# EAGLE design Walletv2 (EAGLE 8.7.0)
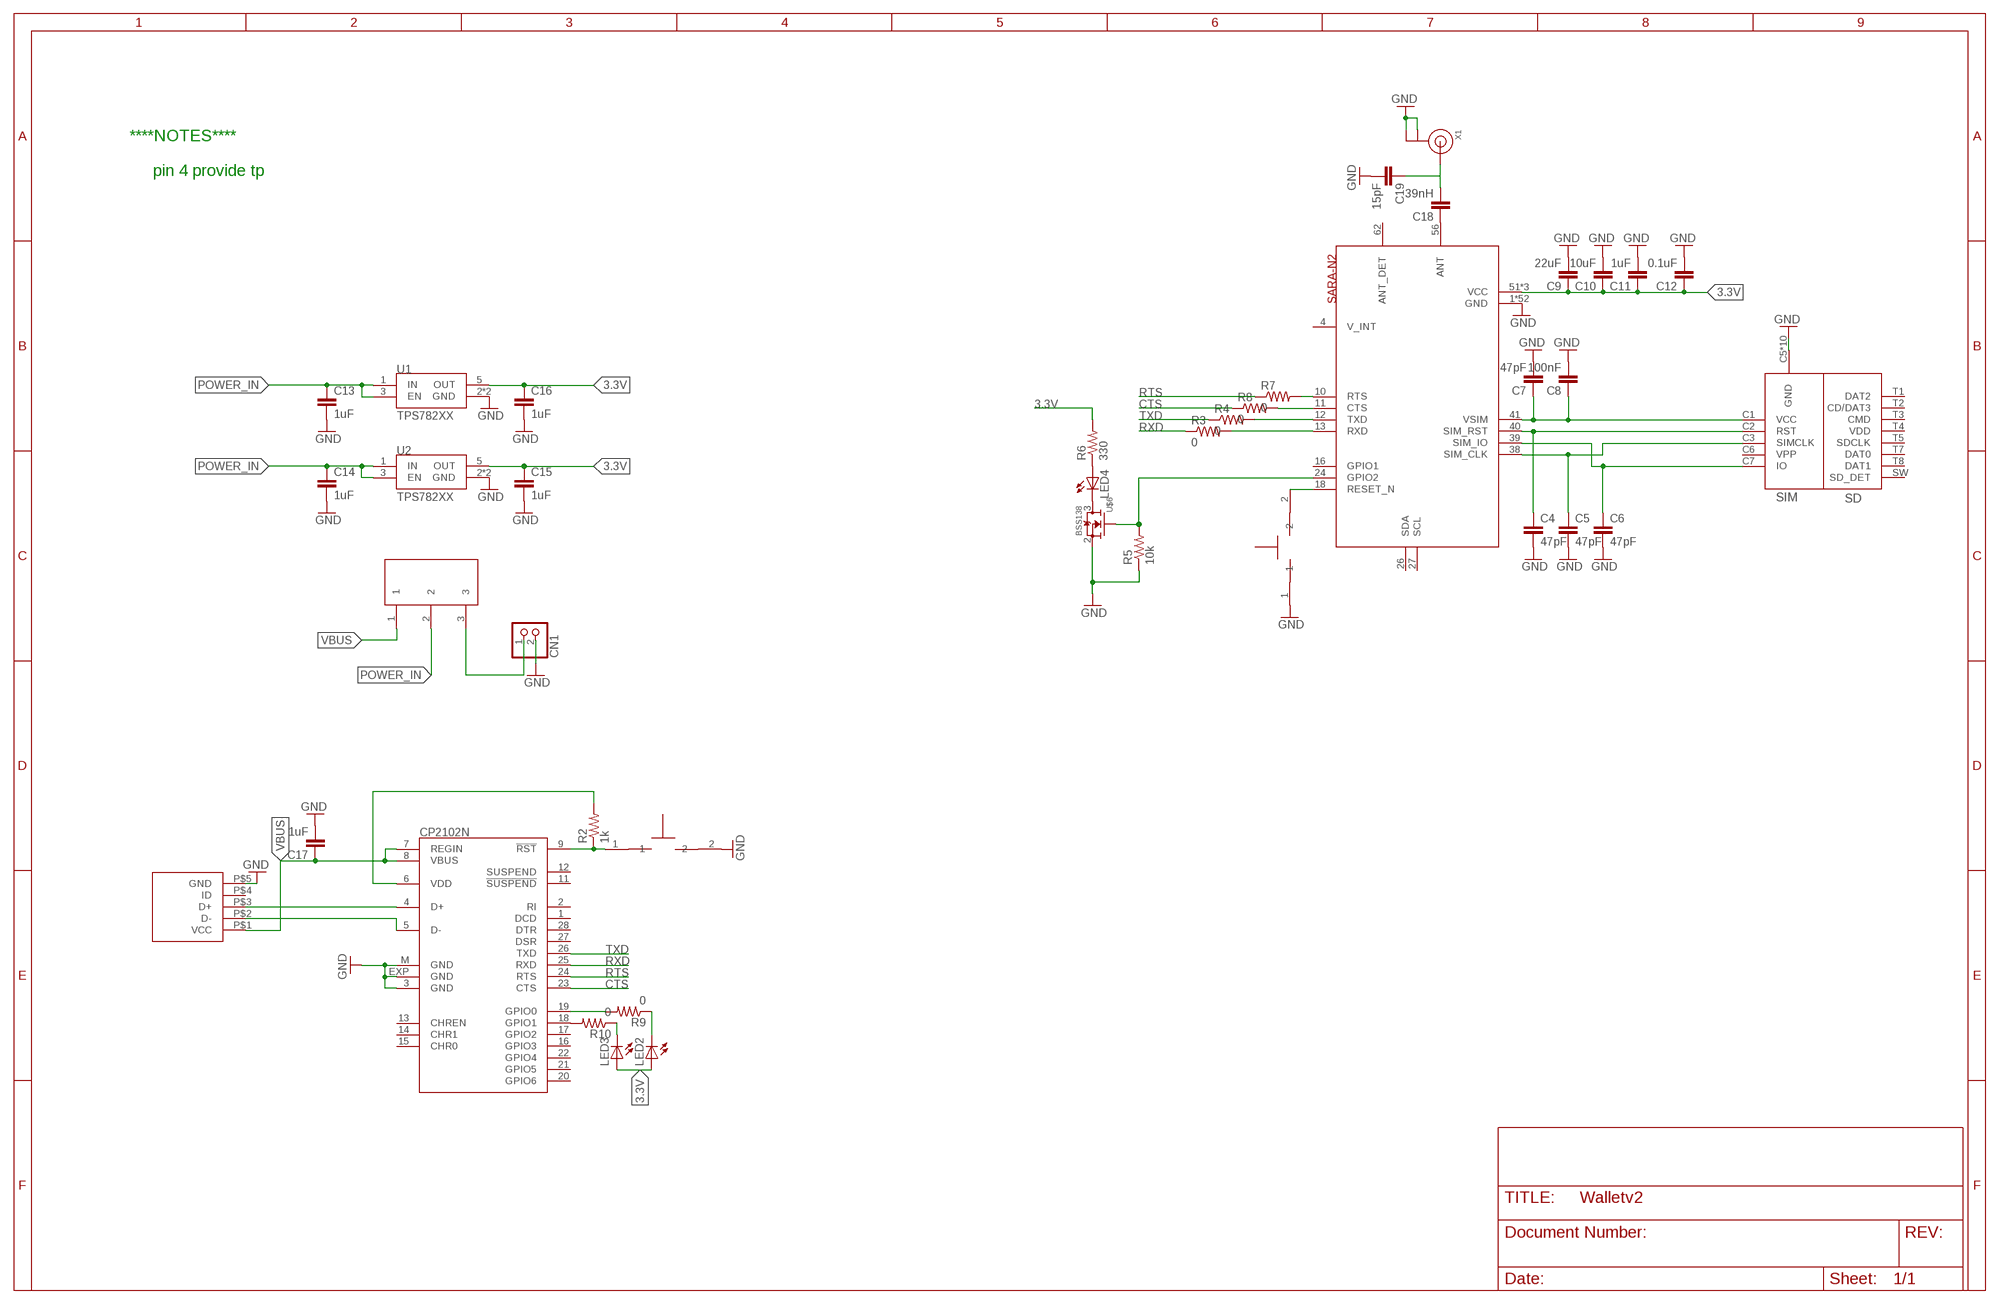
[diagram p0: schematic, sheet 1]

## Parts
C4  47pF  C-EUC0402  [C0402]
C5  47pF  C-EUC0402  [C0402]
C6  47pF  C-EUC0402  [C0402]
C7  47pF  C-EUC0402  [C0402]
C8  100nF  C-EUC0402  [C0402]
C9  22uF  C-EUC0805  [C0805]
C10  10uF  C-EUC0603  [C0603]
C11  1uF  C-EUC0402  [C0402]
C12  0.1uF  C-EUC0402  [C0402]
C13  1uF  C-EUC0402  [C0402]
C14  1uF  C-EUC0402  [C0402]
C15  1uF  C-EUC0402  [C0402]
C16  1uF  C-EUC0402  [C0402]
C17  1uF  C-EUC0402  [C0402]
C18  39nH  C-EUC0402  [C0402]
C19  15pF  C-EUC0402  [C0402]
CN1  JST_2PIN-SMT-RA  [JST-PH-2-SMT-RA]
IC1  CP2102  [MLP28]
LED2  LEDCHIPLED_0603  [CHIPLED_0603]
LED3  LEDCHIPLED_0603  [CHIPLED_0603]
LED4  LEDCHIPLED_0603  [CHIPLED_0603]
R2  1k  R-US_R0402  [R0402]
R3  0  R-US_R0402  [R0402]
R4  0  R-US_R0402  [R0402]
R5  10k  R-US_R0402  [R0402]
R6  330  R-US_R0402  [R0402]
R7  0  R-US_R0402  [R0402]
R8  0  R-US_R0402  [R0402]
R9  0  R-US_R0402  [R0402]
R10  0  R-US_R0402  [R0402]
S1  TACTILE_SKRKA  [TACTILE_SKRKA]
S2  TACTILE_SKRKA  [TACTILE_SKRKA]
U1  TPS782XX  [SOT23-5L]
U2  TPS782XX  [SOT23-5L]
U$1  SARA-N2  [SARA-N2]
U$2  SIM_SD_MOLEX  [SIM_SD_MOLEX]
U$4  SPDT_THRU  [SPDT_THRU]
U$5  MICRO_USB  [MOLEX_USB]
U$6  BSS138  [SOT23-3]
X1  ANTENNA_U.FL  [U.FL]

## Nets
3.3V: C9.1 C10.1 C11.1 C12.1 C15.1 C16.1 LED2.A LED3.A R6.2 U1.5(OUT) U2.5(OUT) U$1.51(VCC) U$1.52(VCC) U$1.53(VCC)
CTS: IC1.23(CTS) R8.1
D_N: IC1.5(D-) U$5.P$2(D-)
D_P: IC1.4(D+) U$5.P$3(D+)
GND: C4.2 C5.2 C6.2 C7.2 C8.2 C9.2 C10.2 C11.2 C12.2 C13.2 C14.2 C15.2 C16.2 C17.2 C19.2 CN1.2 IC1.3(GND) IC1.EXP(GND) IC1.M(GND) R5.1 S1.2 S2.1 U1.2(GND) U1.4(GND) U2.2(GND) U2.4(GND) U$1.1(GND) U$1.3(GND) U$1.5(GND) U$1.14(GND) U$1.20(GND) U$1.21(GND) U$1.22(GND) U$1.30(GND) U$1.32(GND) U$1.43(GND) U$1.50(GND) U$1.54(GND) U$1.55(GND) U$1.57(GND) U$1.58(GND) U$1.59(GND) U$1.60(GND) U$1.61(GND) U$1.63(GND) U$1.64(GND) U$1.65(GND) U$1.66(GND) U$1.67(GND) U$1.68(GND) U$1.69(GND) U$1.70(GND) U$1.71(GND) U$1.72(GND) U$1.73(GND) U$1.74(GND) U$1.75(GND) U$1.76(GND) U$1.77(GND) U$1.78(GND) U$1.79(GND) U$1.80(GND) U$1.81(GND) U$1.82(GND) U$1.83(GND) U$1.84(GND) U$1.85(GND) U$1.86(GND) U$1.87(GND) U$1.88(GND) U$1.89(GND) U$1.90(GND) U$1.91(GND) U$1.92(GND) U$1.93(GND) U$1.94(GND) U$1.95(GND) U$1.96(GND) U$2.C5(GND) U$2.G1(GND) U$2.G2(GND) U$2.G3(GND) U$2.G4(GND) U$2.G5(GND) U$2.G6(GND) U$2.G7(GND) U$2.G8(GND) U$2.T6(GND) U$5.P$5(GND) U$6.2(S) X1.1(GND) X1.2(GND)
N$1: C18.1 U$1.56(ANT)
N$2: C7.1 C8.1 U$1.41(VSIM) U$2.C1(VCC)
N$3: C4.1 U$1.40(SIM_RST) U$2.C2(RST)
N$4: C6.1 U$1.39(SIM_IO) U$2.C7(IO)
N$5: C5.1 U$1.38(SIM_CLK) U$2.C3(SIMCLK)
N$6: S2.2 U$1.18(RESET_N)
N$7: R4.2 U$1.12(TXD)
N$8: R3.2 U$1.13(RXD)
N$9: IC1.9(!RST) R2.1 S1.1
N$10: LED2.C R9.1
N$11: CN1.1 U$4.3
N$12: IC1.6(VDD) R2.2
N$13: IC1.18(GPIO1) R10.2
N$14: LED4.C U$6.3(D)
N$15: LED4.A R6.1
N$16: R5.2 U$1.24(GPIO2) U$6.1(G)
N$17: LED3.C R10.1
N$18: R8.2 U$1.11(CTS)
N$19: R7.2 U$1.10(RTS)
N$20: IC1.19(GPIO0) R9.2
N$21: C18.2 C19.1 X1.3(SIGNAL)
POWER_IN: C13.1 C14.1 U1.1(IN) U1.3(EN) U2.1(IN) U2.3(EN) U$4.2
RTS: IC1.24(RTS) R7.1
RXD: IC1.25(RXD) R3.1
TXD: IC1.26(TXD) R4.1
VBUS: C17.1 IC1.7(REGIN) IC1.8(VBUS) U$4.1 U$5.P$1(VCC)
Unconnected: IC1.1(DCD) IC1.2(RI) IC1.11(!SUSPEND) IC1.12(SUSPEND) IC1.13(CHREN) IC1.14(CHR1) IC1.15(CHR0) IC1.16(GPIO3) IC1.17(GPIO2) IC1.20(GPIO6) IC1.21(GPIO5) IC1.22(GPIO4) IC1.27(DSR) IC1.28(DTR) U$1.4(V_INT) U$1.16(GPIO1) U$1.26(SDA) U$1.27(SCL) U$1.62(ANT_DET) U$2.C6(VPP) U$2.SW(SD_DET) U$2.T1(DAT2) U$2.T2(CD/DAT3) U$2.T3(CMD) U$2.T4(VDD) U$2.T5(SDCLK) U$2.T7(DAT0) U$2.T8(DAT1) U$5.P$4(ID)

## Notes on the sheet
- ****NOTES****
- pin 4 provide tp

## Library data of the parts
C4-C19 = rcl:C-EU: CAPACITOR, European symbol; SPICEPREFIX: C
CN1 = adafruit:JST_2PIN: JST 2-Pin Connectors of various flavors SMT-RA (S2B-PH-SM4) 4UConnector #17311 SMT (B2B-PH-SM4) THM-RA (S2B-PH) THM (B2B-PH)
IC1 = silabs:CP210*: Single-Chip USB to UART Bridge Source: www.silabs.com .. CP2101.pdf / cp2102.pdf; MF: FARNELL; MPN: CP2102-GM; OC_FARNELL: 9282130; OC_NEWARK: 30K5635
LED2-LED4 = adafruit:LED: LED OSRAM: - CHIPLED LG R971, LG N971, LY N971, LG Q971, LY Q971, LO R971, LY R971 LH N974, LH R974 LS Q976, LO Q976, LY Q976 LO Q996 - Hyper CHIPLED LW Q18S LB Q993, LB Q99A, LB R99A - SideLED LS A670, LO A670, LY A670, LG A670, LP A670 LB A673, LV A673, LT A673, LW A673 LH A674 LY A675 LS A676, LA A676, LO A676, LY A676, LW A676 LS A679, LY A679, LG A679 - Hyper Micro SIDELED® LS Y876, LA Y876, LO Y876, LY Y876 LT Y87S - SmartLED LW L88C, LW L88S LB L89C, LB L89S, LG L890 LS L89K, LO L89K, LY L89K LS L896, LA L896, LO L896, LY L896 - TOPLED LS T670, LO T670, LY T670, LG T670, LP T670 LSG T670, LSP T670, LSY T670, LOP T670, LYG T670 LG T671, LOG T671, LSG T671 LB T673, LV T673, LT T673, LW T673 LH T674 LS T676, LA T676, LO T676, LY T676, LB T676, LH T676, LSB T676, LW T676 LB T67C, LV T67C, LT T67C, LS T67K, LO T67K, LY T67K, LW E67C LS E67B, LA E67B, LO E67B, LY E67B, LB E67C, LV E67C, LT E67C LW T67C LS T679, LY T679, LG T679 LS T770, LO T770, LY T770, LG T770, LP T770 LB T773, LV T773, LT T773, LW T773 LH T774 LS E675, LA E675, LY E675, LS T675 LS T776, LA T776, LO T776, LY T776, LB T776 LHGB T686 LT T68C, LB T68C - Hyper Mini TOPLED® LB M676 - Mini TOPLED Santana® LG M470 LS M47K, LO M47K, LY M47K Source: http://www.osram.convergy.de/
R2-R10 = rcl:R-US_: RESISTOR, American symbol; SPICEPREFIX: R
S1 S2 = James_Updated:TACTILE_SKRKA
U1 U2 = James_Updated:TPS782XX: TPS782 500-nA IQ,150-mA, Ultra-Low Quiescent Current Low-Dropout Linear Regulator
U$1 = Charles:SARA-N2
U$2 = Charles:SIM_SD_MOLEX
U$4 = James_Updated:SPDT_THRU
U$5 = Charles:MICRO_USB: Molex Micro USB AB RA SMD Bottom Mount
U$6 = Charles:BSS138: MOSFET N-CH 50V 220MA
X1 = adafruit:ANTENNA_U.FL: U.FL Antenna Connector

## Board
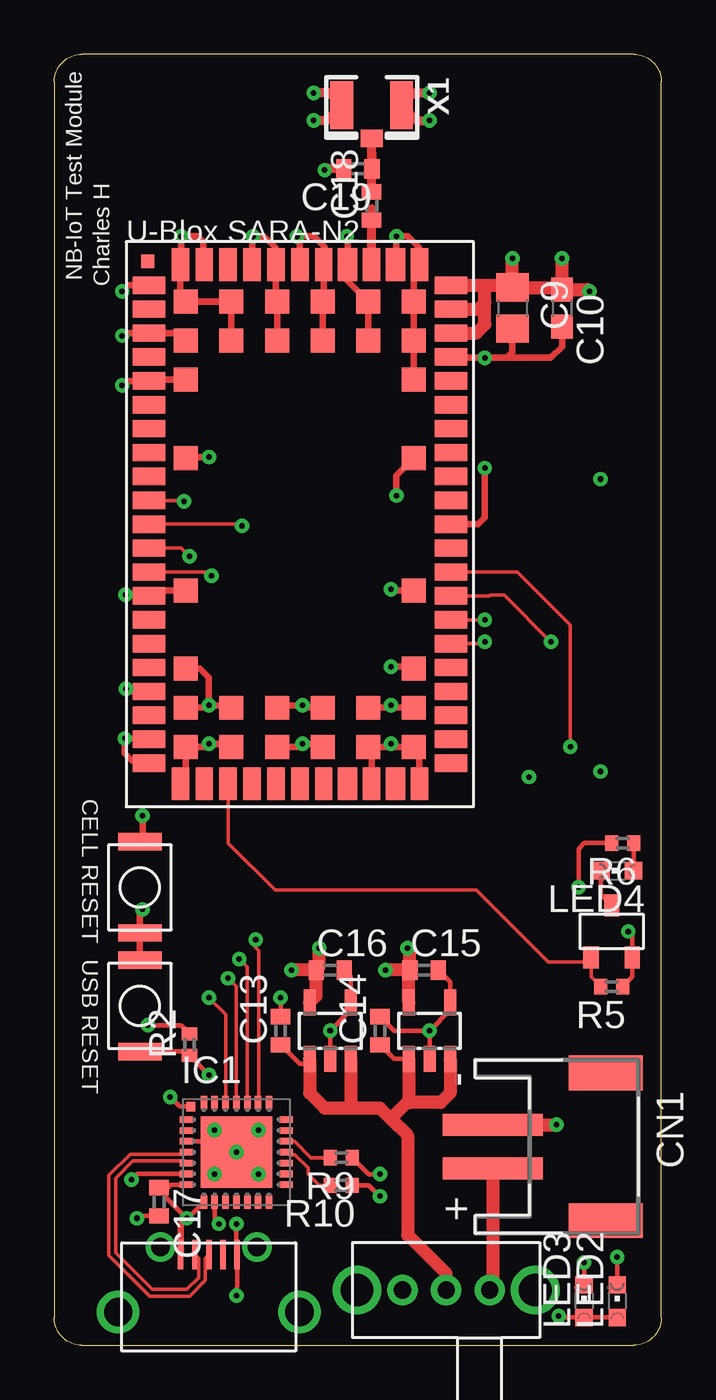
[diagram p1: board, top side]
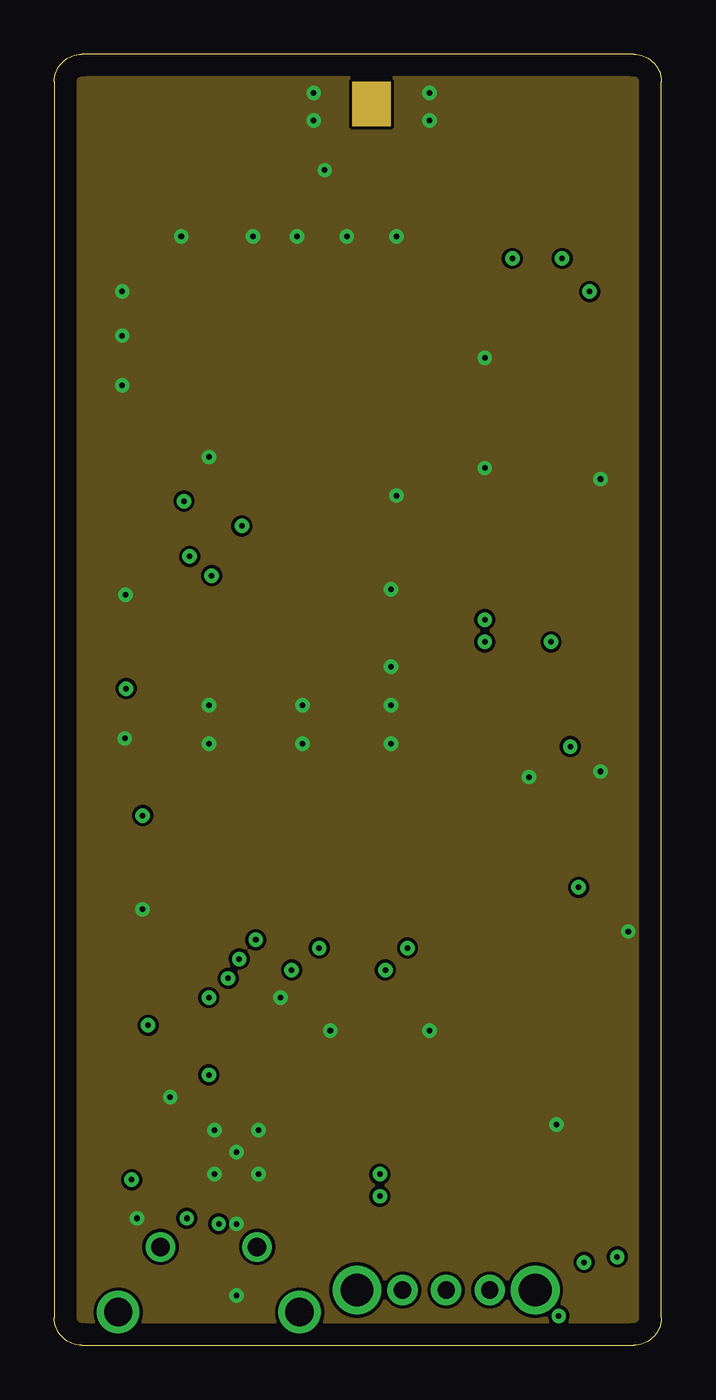
[diagram p2: board, inner layer Ground]
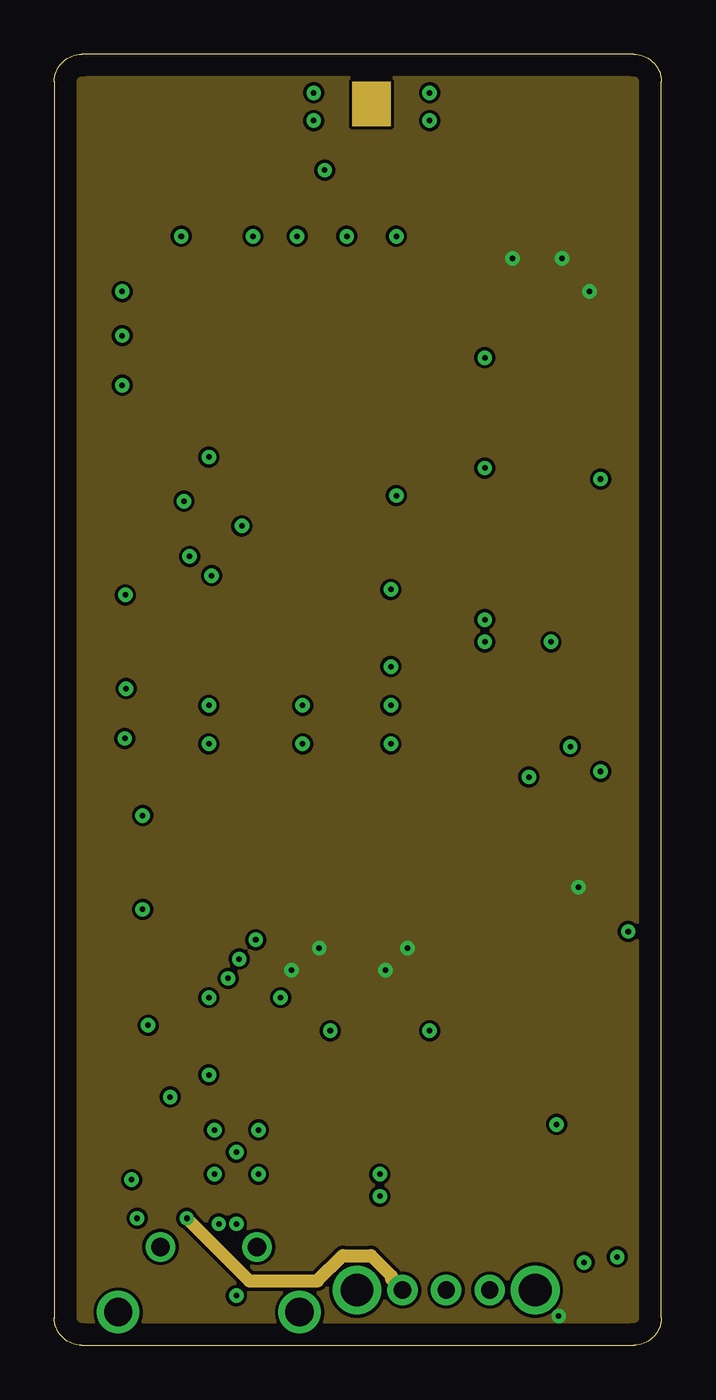
[diagram p3: board, inner layer Power]
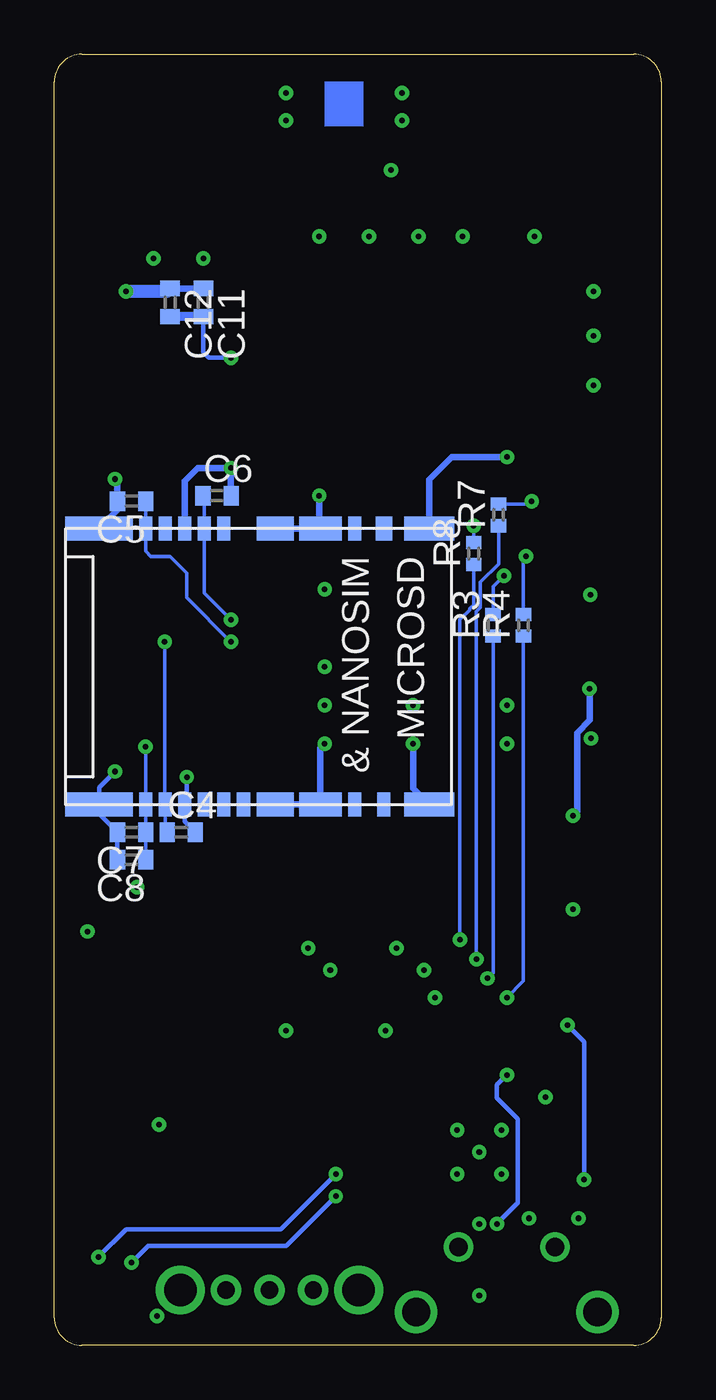
[diagram p4: board, bottom side, seen from below]

Size 27.94 x 59.44 mm. Coordinates in mm from the lower left corner, seen from the top.
Outline: 1.27,0 26.67,0 arc90 27.94,1.27 27.94,58.17 arc90 26.67,59.44 1.27,59.44 arc90 0,58.17 0,1.27 arc90 1.27,0
Copper layers (1*2+15*16): Top 0.035mm / dielectric 1.5mm / Ground 0.035mm / dielectric 0.15mm / Power 0.035mm / dielectric 0.2mm / Bottom 0.035mm
Design rules "default *": minimum track width 6mil, minimum drill 0.35mm, track to track 6mil, track to pad 6mil, pad to pad 6mil, via to via 6mil, smd to smd 6mil, copper to edge 40mil, drill to drill 6mil, minimum pad ring 10mil, minimum via ring 8mil, stop-mask expansion 4mil, vias tented up to drill 0mil, thermal gap 10mil

### Footprints (pad centres in the part's own frame; a part is rotated, then mirrored left to right if it is on the bottom)
C0402 = smd 0.7 x 0.9: 1 -0.65,0; 2 0.65,0
C0805 = smd 1.3 x 1.5: 1 -0.95,0; 2 0.95,0
C0603 = smd 1.1 x 1: 1 -0.85,0; 2 0.85,0
JST-PH-2-SMT-RA = smd 1 x 4.6: 1 1,-3.7; 2 -1,-3.7 | smd 1.6 x 3.4: NC1 -3.4,1.5; NC2 3.4,1.5
MLP28 = smd 0.6 x 0.3: 1 -2.3,1.5; 2 -2.3,1; 3 -2.3,0.5; 4 -2.3,0; 5 -2.3,-0.5; 6 -2.3,-1; 7 -2.3,-1.5; 15 2.3,-1.5; 16 2.3,-1; 17 2.3,-0.5; 18 2.3,0; 19 2.3,0.5; 20 2.3,1; 21 2.3,1.5 | smd 0.3 x 0.6: 8 -1.5,-2.3; 9 -1,-2.3; 10 -0.5,-2.3; 11 0,-2.3; 12 0.5,-2.3; 13 1,-2.3; 14 1.5,-2.3; 22 1.5,2.3; 23 1,2.3; 24 0.5,2.3; 25 0,2.3; 26 -0.5,2.3; 27 -1,2.3; 28 -1.5,2.3 | smd 3.3 x 3.3: EXP 0,0 | smd 0.435 x 0.435: M -2.103,2.103
CHIPLED_0603 = smd 0.8 x 0.8: A 0,-0.75; C 0,0.75
R0402 = smd 0.6 x 0.7: 1 -0.5,0; 2 0.5,0
TACTILE_SKRKA = smd 0.8 x 2: 1 -2.1,0; 2 2.1,0
SOT23-5L = smd 0.55 x 1.2: 1 -0.95,-1.3; 2 0,-1.3; 3 0.95,-1.3; 4 0.95,1.3; 5 -0.95,1.3
SARA-N2 = smd 1.5 x 0.8: 1 1.05,-2; 2 1.05,-3.1; 3 1.05,-4.2; 4 1.05,-5.3; 5 1.05,-6.4; 6 1.05,-7.5; 7 1.05,-8.6; 8 1.05,-9.7; 9 1.05,-10.8; 10 1.05,-11.9; 11 1.05,-13; 12 1.05,-14.1; 13 1.05,-15.2; 14 1.05,-16.3; 15 1.05,-17.4; 16 1.05,-18.5; 17 1.05,-19.6; 18 1.05,-20.7; 19 1.05,-21.8; 20 1.05,-22.9; 21 1.05,-24; 33 14.95,-24; 34 14.95,-22.9; 35 14.95,-21.8; 36 14.95,-20.7; 37 14.95,-19.6; 38 14.95,-18.5; 39 14.95,-17.4; 40 14.95,-16.3; 41 14.95,-15.2; 42 14.95,-14.1; 43 14.95,-13; 44 14.95,-11.9; 45 14.95,-10.8; 46 14.95,-9.7; 47 14.95,-8.6; 48 14.95,-7.5; 49 14.95,-6.4; 50 14.95,-5.3; 51 14.95,-4.2; 52 14.95,-3.1; 53 14.95,-2 | smd 0.8 x 1.5: 22 2.5,-24.95; 23 3.6,-24.95; 24 4.7,-24.95; 25 5.8,-24.95; 26 6.9,-24.95; 27 8,-24.95; 28 9.1,-24.95; 30 11.3,-24.95; 32 13.5,-24.95; 54 13.5,-1.05; 56 11.3,-1.05; 58 9.1,-1.05; 59 8,-1.05; 60 6.9,-1.05; 61 5.8,-1.05; 62 4.7,-1.05; 63 3.6,-1.05; 64 2.5,-1.05 | smd 0.9 x 1.5: 29 10.2,-24.95; 31 12.4,-24.95; 55 12.4,-1.05; 57 10.2,-1.05 | smd 1.1 x 1.1: 65 2.75,-2.75; 66 4.85,-2.75; 67 6.95,-2.75; 68 9.05,-2.75; 69 11.15,-2.75; 70 13.25,-2.75; 71 2.75,-4.55; 72 4.85,-4.55; 73 6.95,-4.55; 74 9.05,-4.55; 75 11.15,-4.55; 76 13.25,-4.55; 77 2.75,-6.35; 78 13.25,-6.35; 79 2.75,-9.95; 80 13.25,-9.95; 81 2.75,-16.05; 82 13.25,-16.05; 83 2.75,-19.65; 84 13.25,-19.65; 85 2.75,-21.45; 86 4.85,-21.45; 87 6.95,-21.45; 88 9.05,-21.45; 89 11.15,-21.45; 90 13.25,-21.45; 91 2.75,-23.25; 92 4.85,-23.25; 93 6.95,-23.25; 94 9.05,-23.25; 95 11.15,-23.25; 96 13.25,-23.25 | smd 0.6 x 0.6: P$1 1,-0.9
SIM_SD_MOLEX = smd 1.1 x 0.6: C1 6.35,3.7; C2 6.35,4.6; C3 -6.35,3.7; C5 6.35,5.5; C6 -6.35,4.6; C7 -6.35,6.4; T1 6.35,14.665; T2 6.35,13.31; T3 6.35,8.2; T4 6.35,7.3; T5 6.35,6.4; T6 -6.35,5.5; T7 -6.35,7.3; T8 -6.35,13.31 | smd 1.1 x 3.1: G1 -6.35,1.55; G8 6.35,1.55 | smd 1.1 x 1.72: G2 -6.35,9.66; G7 6.35,9.66 | smd 1.1 x 1.94: G3 -6.35,11.74; G6 6.35,11.74 | smd 1.1 x 2.3: G4 -6.35,16.75; G5 6.35,16.75 | smd 1.1 x 0.75: SW -6.35,14.665
SPDT_THRU = drill 0.787 pad 1.397: 1 -2.007,0; 2 0,0; 3 2.007,0 | drill 1.499: A1 -4.102,0; A2 4.102,0
MOLEX_USB = smd 0.25 x 1.35: P$1 -1.3,2.65; P$2 -0.65,2.65; P$3 0,2.65; P$4 0.65,2.65; P$5 1.3,2.65 | drill 0.85 pad 1.256: P$6 -2.225,3; P$7 2.225,3 | drill 1.3: P$8 -4.175,0; P$9 4.175,0
SOT23-3 = smd 0.7 x 1: 1 -0.95,-1.2; 2 0.95,-1.2; 3 0,1.2
U.FL = smd 2.2 x 1.05: 1 0,1.375; 2 0,-1.375 | smd 0.8 x 1: 3 1.525,0

### Placement (x,y rotation side)
C4  22.1,23.62 0 bottom
C5  24.38,38.86 180 bottom
C6  20.45,39.12 0 bottom
C7  24.38,23.62 180 bottom
C8  24.38,22.35 180 bottom
C9  21.08,47.75 270 top
C10  23.37,47.75 270 top
C11  21.08,48.01 270 bottom
C12  22.61,48.01 270 bottom
C13  10.41,14.48 90 top
C14  14.99,14.48 90 top
C15  17.02,17.27 0 top
C16  12.7,17.27 0 top
C17  4.83,6.6 270 top
C18  14.61,52.45 90 top
C19  13.97,54.17 180 top
CN1  23.88,9.14 270 top
IC1  8.38,8.89 0 top
LED2  25.91,2.03 0 top
LED3  24.38,2.03 0 top
LED4  25.91,21.84 90 top
R2  6.22,13.84 90 top
R3  7.75,33.15 90 bottom
R4  6.35,33.15 90 bottom
R5  25.65,16.51 180 top
R6  26.16,23.11 180 top
R7  7.49,38.23 90 bottom
R8  8.64,36.45 90 bottom
R9  13.21,8.64 180 top
R10  13.21,7.37 180 top
S1  3.94,15.62 90 top
S2  3.94,21.08 90 top
U1  12.7,14.48 0 top
U2  17.27,14.48 0 top
U$1  3.3,50.8 0 top
U$2  27.43,31.24 270 bottom
U$4  18.03,2.54 0 top
U$5  7.11,1.52 0 top
U$6  25.65,19.05 0 top
X1  14.61,57.09 270 top

### Tracks (layer width: path | path; a pad name or v marks a point on that pad's centre or on a via)
3.3V  (via drill 0.25)
  Top 0.203: R6.2 24.38,23.11 24.13,22.86 v24.13,21.08 | LED2.A LED3.A 23.28,1.28 v23.21,1.35
  Top 0.61: U2.5 16.32,17.23 C15.1 | C15.1 16.37,18.18 v16.26,18.29 | U1.5 12.05,16.08 C16.1 | C16.1 12.19,17.41 v12.19,18.29 | C16.1 v10.92,17.27 | C15.1 v15.24,17.27 | U$1.53 19.81,48.8 | 19.81,48.8 20.98,48.8 C9.1 | U$1.52 19.51,47.7 19.81,48.01 | 19.81,48.01 19.81,48.8 | U$1.51 19.42,46.6 19.81,46.99 19.81,48.01 | C9.1 23.27,48.7 C10.1 | C10.1 24.55,48.6 v24.64,48.51 | C9.1 v21.08,50.04 | C10.1 v23.37,50.04
  Power 0.203: v23.21,1.35 23.21,1.22 23.11,1.12
  Bottom 0.305: C11.1 C12.1
  Bottom 0.61: C12.1 22.75,48.51 v24.64,48.51
  pour Power: -1.78,-9.91 -1.52,65.79 42.93,65.79 42.67,-9.91
CTS  (via drill 0.25)
  Top 0.152: v9.27,18.67 9.27,18.29 9.4,18.16 9.4,11.21 IC1.23
  Bottom 0.152: R8.1 8.64,34.09 8.81,33.91 8.81,33.86 9.27,33.4 v9.27,18.67
D_N
  Top 0.152: IC1.5 5.99,8.48 3.62,8.48 2.82,7.68 2.82,4.25 4.51,2.56 6.1,2.56 6.64,3.11 6.64,3.99 U$5.P$2
D_P
  Top 0.152: IC1.4 5.98,8.79 3.49,8.79 2.52,7.81 2.52,4.13 4.38,2.26 6.22,2.26 6.95,2.98 6.95,4.01 U$5.P$3
GND  (via drill 0.25)
  Top 0.203: C17.2 3.92,5.95 v3.81,5.84 | v8.38,2.29 8.41,2.82 U$5.P$5 8.38,4.2 v8.38,5.59 | U1.2 v12.7,14.48 13.65,15.43 U1.4 13.65,16.97 C16.2 | C13.2 v10.41,16 | U2.2 v17.27,14.48 | v17.27,14.48 18.22,15.43 U2.4 18.22,16.72 C15.2 | C14.2 15.64,14.48 v17.27,14.48 | R5.1 26.6,16.96 U$6.2 26.6,18.86 v26.42,19.05 | IC1.3 7.88,9.39 IC1.EXP | IC1.M 5.77,10.99 v5.33,11.43
  Top 0.305: v3.12,46.48 3.24,46.6 U$1.3 5.7,46.6 U$1.71 | v3.12,44.2 3.33,44.4 U$1.5 4.4,44.45 U$1.77 | U$1.1 3.41,48.8 v3.12,48.51 | U$1.61 9.1,51.01 | 9.1,51.01 v9.14,51.05 | U$1.59 11.3,50.93 | 11.3,50.93 v11.18,51.05 | U$1.50 18.29,45.47 v19.81,45.47 20.83,45.47 | C9.2 21.08,45.72 20.83,45.47 | C10.2 23.37,45.97 22.86,45.47 20.83,45.47 | U$1.80 15.75,40.05 v15.75,39.12 | U$1.43 19.51,37.8 19.81,38.1 v19.81,40.39 | U$1.82 15.54,34.75 v15.49,34.8 | U$1.84 16.46,31.24 v15.49,31.24 | U$1.90 15.61,29.35 | 15.61,29.35 v15.49,29.46 | U$1.89 15.61,29.35 | U$1.88 11.54,29.35 v11.43,29.46 10.37,29.46 U$1.87 | U$1.93 11.29,27.55 v11.43,27.69 12.22,27.69 U$1.94 | U$1.92 8.02,27.69 v7.11,27.69 6.98,27.55 U$1.91 6.05,26.1 U$1.22 | U$1.85 7,29.35 v7.11,29.46 | U$1.86 8.04,29.46 v7.11,29.46 | U$1.83 6.7,31.15 7.11,30.73 v7.11,29.46 | U$1.20 4.32,27.94 v3.24,27.94 3.24,27.24 3.56,26.92 4.23,26.92 U$1.21 | U$1.81 4.6,34.75 U$1.14 4.31,34.54 v3.27,34.54 | U$1.79 6.1,40.89 v7.11,40.89 | U$1.63 6.86,49.79 6.86,50.8 6.6,51.05 v5.84,51.05 5.84,49.79 U$1.64 5.8,48.3 U$1.65 U$1.66 U$1.72 | 9.1,51.01 9.69,51.01 10.16,50.55 10.16,49.79 U$1.60 10.2,47.8 10.25,47.75 | 11.3,50.93 11.43,51.05 11.94,51.05 12.45,50.55 12.45,49.79 U$1.58 12.4,48.1 U$1.68 U$1.74 | U$1.67 10.25,47.75 | 10.25,47.75 U$1.73 | U$1.75 U$1.69 13.5,49 U$1.57 13.5,51.01 v13.46,51.05 | U$1.55 15.75,49.8 v15.75,51.05 16.26,51.05 16.76,50.55 16.76,49.79 U$1.54 16.55,49.5 U$1.70 U$1.76 U$1.78 | U$1.30 14.6,27.4 U$1.95 15.36,27.55 v15.49,27.69 15.63,27.55 U$1.96 16.8,27.3 U$1.32 | S1.2 S2.1 3.94,19.94 v4.06,20.07
  Top 0.406: C19.2 12.51,54.17 v12.45,54.1 | v11.94,57.66 12.66,57.66 X1.2 12.53,56.39 v11.94,56.39 | v17.27,57.66 16.55,57.66 X1.1 16.68,56.39 v17.27,56.39
  Top 0.61: CN1.2 23.1,10.14 v23.11,10.16
  Ground 0.305: v3.12,46.48 3.05,46.48 | v3.12,44.2 3.05,44.2 | v3.12,48.51 2.95,48.51 | v3.27,34.54 3.09,34.54
  Bottom 0.203: C4.2 21.93,24.11 U$2.C5 21.84,24.98 v21.84,26.16 | C8.2 C7.2 25.88,24.47 U$2.G8 25.88,25.68 v25.15,26.42 | C11.2 21.08,45.72 20.83,45.47 v19.81,45.47
  Bottom 0.305: v15.75,39.12 15.75,37.65 U$2.G3 U$2.G2 | C6.2 19.81,39.13 v19.81,40.39 21.34,40.39 21.93,39.79 U$2.T6 | U$2.G4 10.68,39.86 9.65,40.89 v7.11,40.89 | U$2.G1 25.03,38.44 C5.2 25.03,39.77 v25.15,39.88 | U$2.G5 11.43,25.64 v11.43,27.69 | v15.49,27.69 15.69,27.49 U$2.G6 U$2.G7
  Bottom 0.406: C11.2 C12.2
  other vias: 8.38,8.89 7.37,9.91 7.37,7.87 9.4,7.87 9.4,9.91
  pour Ground: 0.13,64.9 -0.13,-8.89 41.4,-8.89 41.66,64.9
N$1
  Top 0.406: U$1.56 14.6,52.31 C18.1
N$2  (via drill 0.25)
  Top 0.152: U$1.41 21.3,35.6 23.75,33.15 v23.75,27.56
  Bottom 0.152: C8.1 C7.1 U$2.C1 23.73,27.54 v23.75,27.56
N$3  (via drill 0.25)
  Top 0.152: U$1.40 20.02,34.5 20.07,34.54 20.7,34.54 v22.86,32.38
  Bottom 0.152: C4.1 22.83,23.71 U$2.C2 22.86,24.92 v22.86,32.38
N$4  (via drill 0.25)
  Top 0.152: U$1.39 v19.81,33.4
  Bottom 0.152: C6.1 21.03,38.92 21.03,37.72 U$2.C7 21.03,34.62 v19.81,33.4
N$5  (via drill 0.25)
  Top 0.152: U$1.38 19.73,32.3 v19.81,32.38
  Bottom 0.152: C5.1 U$2.C3 23.73,36.56 23.49,36.32 22.61,36.32 21.84,35.56 21.84,34.42 v19.81,32.38
N$6  (via drill 0.25)
  Top 0.305: U$1.18 3.43,30.1 v3.3,30.23 | v4.06,24.38 4.06,23.31 S2.2
  Bottom 0.305: v3.3,30.23 3.3,28.78 3.88,28.2 3.88,24.57 v4.06,24.38
N$7  (via drill 0.25)
  Top 0.152: U$1.12 5.85,36.7 v6.22,36.32
  Bottom 0.152: v6.22,36.32 6.35,36.2 R4.2
N$8  (via drill 0.25)
  Top 0.152: v7.24,35.43 7.07,35.6 U$1.13
  Bottom 0.152: R3.2 7.75,34.92 v7.24,35.43
N$9  (via drill 0.25)
  Top 0.203: S1.1 6.04,13.52 R2.1 v7.11,12.45 | IC1.9 7.38,5.78 v7.57,5.59
  Bottom 0.203: v7.11,12.45 7.57,11.99 7.57,11.38 6.6,10.41 6.6,6.55 v7.57,5.59
N$10  (via drill 0.25)
  Top 0.203: R9.1 14.47,7.87 v14.99,7.87 | v25.91,4.06 LED2.C
  Bottom 0.203: v14.99,7.87 17.53,5.33 24.64,5.33 v25.91,4.06
N$11
  Top 0.61: CN1.1 20.18,2.67 U$4.3
N$12  (via drill 0.25)
  Top 0.203: IC1.6 3.83,7.89 v3.56,7.62 | R2.2 5.83,14.73 v4.32,14.73
  Bottom 0.203: v3.56,7.62 3.56,13.97 v4.32,14.73
N$13
  Top 0.152: IC1.18 10.8,8.77 11.08,8.77 11.68,8.16 11.68,7.87 12.19,7.37 R10.2
N$14
  Top 0.203: LED4.C 25.16,20.75 U$6.3
N$15
  Top 0.203: LED4.A R6.1
N$16
  Top 0.152: U$6.1 24.7,17.65 | 24.7,17.65 24.7,16.96 R5.2 | U$1.24 8,23.11 10.16,20.95 19.43,20.95 22.73,17.65 24.7,17.65
N$17  (via drill 0.25)
  Top 0.203: R10.1 14.48,7.37 v14.99,6.86 | v24.38,3.81 LED3.C
  Bottom 0.203: v14.99,6.86 17.27,4.57 23.62,4.57 v24.38,3.81
N$18  (via drill 0.25)
  Top 0.152: U$1.11 8.55,37.8 v8.64,37.72
  Bottom 0.152: v8.64,37.72 R8.2
N$19  (via drill 0.25)
  Top 0.152: U$1.10 5.93,38.9 v5.97,38.86
  Bottom 0.152: v5.97,38.86 6.1,38.73 R7.2
N$20
  Top 0.152: IC1.19 11.06,9.39 11.81,8.64 R9.2
N$21
  Top 0.406: C18.2 14.61,54.91 C19.1 14.62,55.55 X1.3
POWER_IN
  Top 0.203: C13.1 11.29,12.95 11.75,12.95 | C14.1 15.64,13.18 U2.1
  Top 0.61: U$4.2 18.03,3.3 16.26,5.08 16.26,9.65 15.49,10.41 | U1.1 11.75,12.95 11.75,11.62 12.45,10.92 13.46,10.92 | 13.46,10.92 14.99,10.92 15.49,10.41 | U1.3 13.65,11.11 13.46,10.92 | U2.1 16.32,11.24 | 16.32,11.24 15.49,10.41 | U2.3 18.22,11.62 17.78,11.18 16.39,11.18 16.32,11.24
RTS  (via drill 0.25)
  Top 0.152: IC1.24 8.88,17.41 v8.51,17.78
  Bottom 0.152: v8.51,17.78 8.51,33.78 8.33,33.97 8.33,35.14 7.49,35.97 R7.1
RXD  (via drill 0.25)
  Top 0.152: v8,16.89 8.38,16.51 IC1.25
  Bottom 0.152: R3.1 7.75,17.14 v8,16.89
TXD  (via drill 0.25)
  Top 0.152: v7.11,16 7.88,15.23 IC1.26
  Bottom 0.152: R4.1 6.35,16.76 v7.11,16
VBUS  (via drill 0.25)
  Top 0.203: C17.1 5.08,7.25 | 5.08,7.25 5.22,7.25 5.36,7.39 IC1.7 | 5.08,7.25 5.08,6.86 5.53,6.41 v6.1,5.84 6.13,5.84 IC1.8
  Top 0.305: U$5.P$1 5.81,5.56 v6.1,5.84
  Power 0.61: U$4.1 15.51,3.05 15.51,3.19 14.59,4.12 13.28,4.12 12.11,2.96 8.98,2.96 v6.1,5.84
(copper drawn outside any net)
  shapes: Bottom area x1, Ground area x1, Power area x1

### Text on the board
tPlace: NB-IoT Test Module | Charles H | CELL RESET | USB RESET